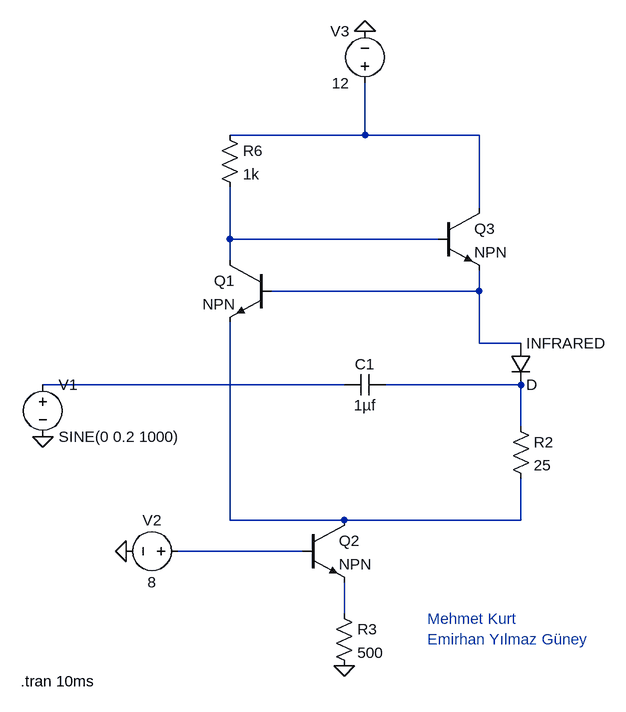
[diagram p0: schematic Transmitter-LED Modulator Circuit.asc]
Transmitter-LED Modulator Circuit.asc, the LTspice schematic file:
Version 4
SHEET 1 880 904
WIRE 368 48 368 -32
WIRE 368 48 160 48
WIRE 544 48 368 48
WIRE 544 160 544 48
WIRE 160 208 160 128
WIRE 480 208 160 208
WIRE 160 240 160 208
WIRE 544 288 544 256
WIRE 544 288 224 288
WIRE 544 368 544 288
WIRE 608 368 544 368
WIRE 336 432 -128 432
WIRE 608 432 400 432
WIRE 608 496 608 432
WIRE 160 640 160 336
WIRE 336 640 160 640
WIRE 608 640 608 576
WIRE 608 640 336 640
WIRE 272 688 80 688
WIRE 336 784 336 736
FLAG -128 512 0
FLAG 336 864 0
FLAG 0 688 0
FLAG 368 -112 0
SYMBOL res 144 32 R0
SYMATTR InstName R6
SYMATTR Value 1k
SYMBOL npn 224 240 M0
SYMATTR InstName Q1
SYMBOL cap 336 416 M90
WINDOW 0 0 32 VBottom 2
WINDOW 3 32 32 VTop 2
SYMATTR InstName C1
SYMATTR Value 1µf
SYMBOL voltage -128 416 R0
WINDOW 123 0 0 Left 0
WINDOW 39 0 0 Left 0
SYMATTR InstName V1
SYMATTR Value SINE(0 0.2 1000)
SYMBOL voltage 96 688 R90
WINDOW 0 -32 56 VBottom 2
WINDOW 3 32 56 VTop 2
WINDOW 123 0 0 Left 0
WINDOW 39 0 0 Left 0
SYMATTR InstName V2
SYMATTR Value 8
SYMBOL npn 272 640 R0
SYMATTR InstName Q2
SYMBOL npn 480 160 R0
SYMATTR InstName Q3
SYMBOL res 320 768 R0
SYMATTR InstName R3
SYMATTR Value 500
SYMBOL res 592 480 R0
SYMATTR InstName R2
SYMATTR Value 25
SYMBOL voltage 368 -16 R180
WINDOW 0 24 96 Left 2
WINDOW 3 24 16 Left 2
WINDOW 123 0 0 Left 0
WINDOW 39 0 0 Left 0
SYMATTR InstName V3
SYMATTR Value 12
SYMBOL diode 592 368 R0
SYMATTR InstName INFRARED
TEXT -162 888 Left 2 !.tran 10ms
TEXT 464 792 Left 2 ;Mehmet Kurt \nEmirhan Yılmaz Güney

The netlist it stands for:
* Transmitter-LED Modulator Circuit.asc
R6 N001 N002 1k
Q1 N002 N003 N006 0 NPN
C1 N004 N005 1µf
V1 N004 0 SINE(0 0.2 1000)
V2 N007 0 8
Q2 N006 N007 N008 0 NPN
Q3 N001 N002 N003 0 NPN
R3 N008 0 500
R2 N005 N006 25
V3 N001 0 12
D§INFRARED N003 N005 D
.model D D
.lib standard.dio
.model NPN NPN
.model PNP PNP
.lib standard.bjt
.tran 10ms
* Mehmet Kurt
* Emirhan Yılmaz Güney
.backanno
.end